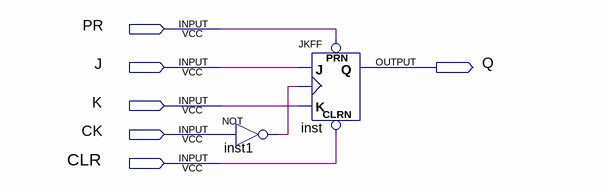
[diagram p0: schematic sheet]
// Quartus schematic JK_FF.bdf as structural Verilog: 2 symbols, 6 pins
module JK_FF (
  input  PR,
  input  J,
  input  K,
  input  CK,
  input  CLR,
  output Q
);

  wire inst1_out;

  not inst1 (inst1_out, CK);
  JKFF inst (.PRN(PR), .CLRN(CLR), .K(K), .J(J), .CLK(inst1_out), .Q(Q));
endmodule
